# Altium schematic sheet CAN_BlockDiagram.SchDoc
size A3; SheetNumber: 1; SheetTotal: 1
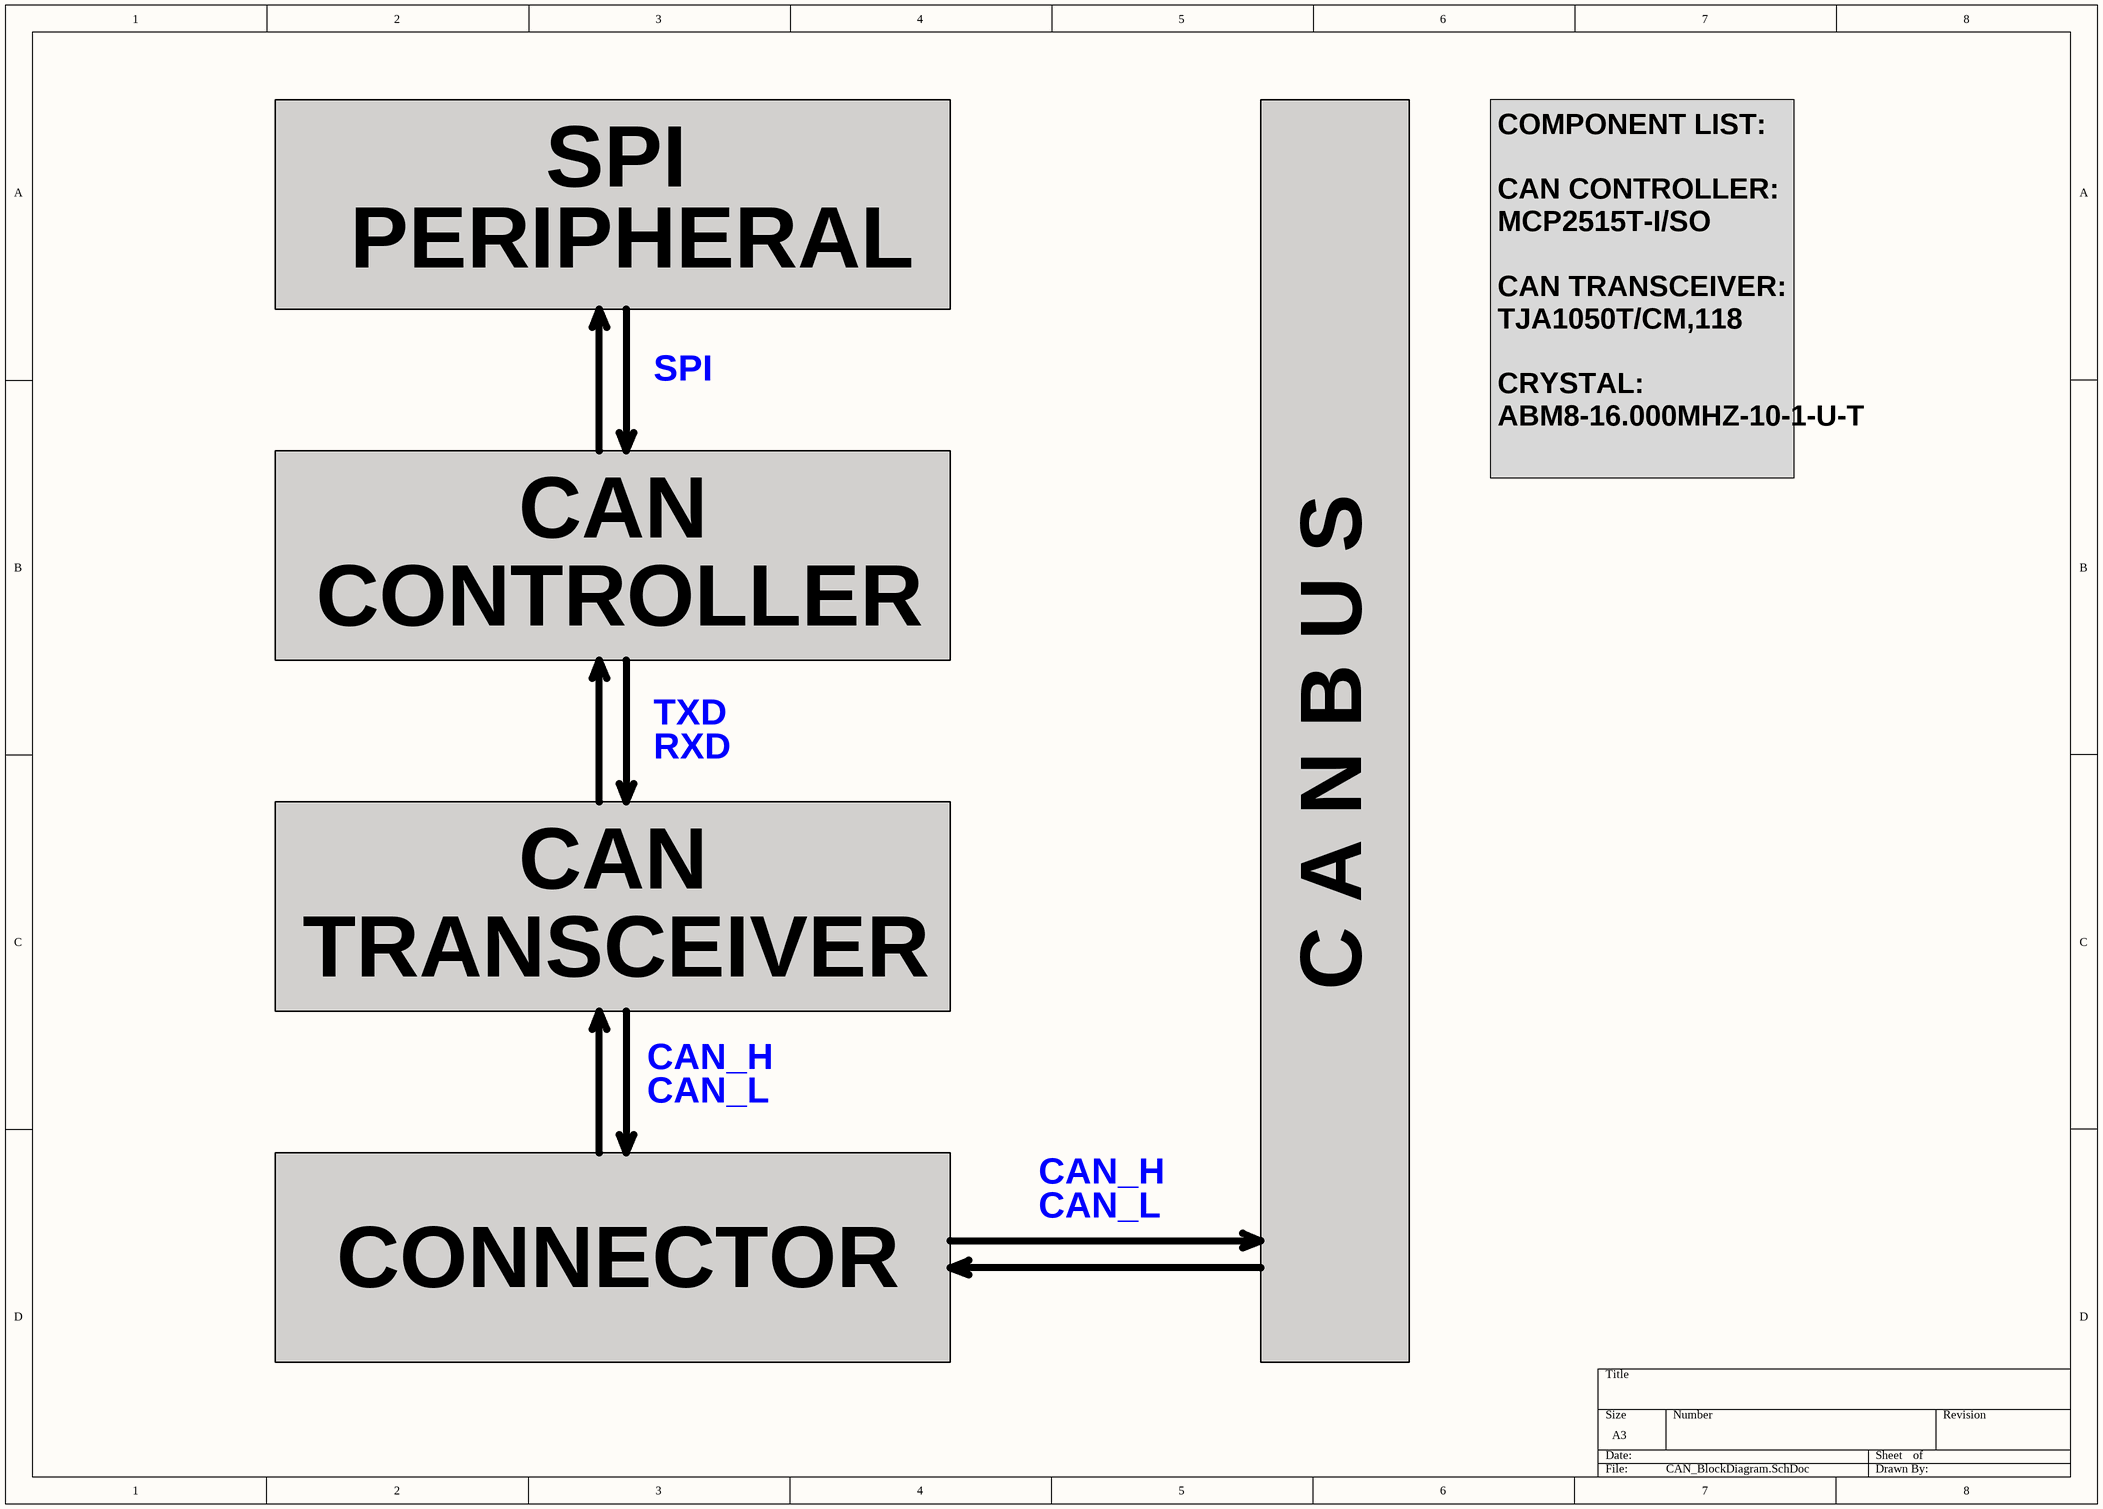
[diagram p0: CAN_BlockDiagram.SchDoc]

## Notes on the sheet
- SPI
- PERIPHERAL
- COMPONENT LIST:
  CAN CONTROLLER: MCP2515T-I/SO
  CAN TRANSCEIVER: TJA1050T/CM,118
  CRYSTAL: ABM8-16.000MHZ-10-1-U-T
- CAN
- CONTROLLER
- TXD
- RXD
- TRANSCEIVER
- C A N B U S
- CAN_H
- CAN_L
- CONNECTOR